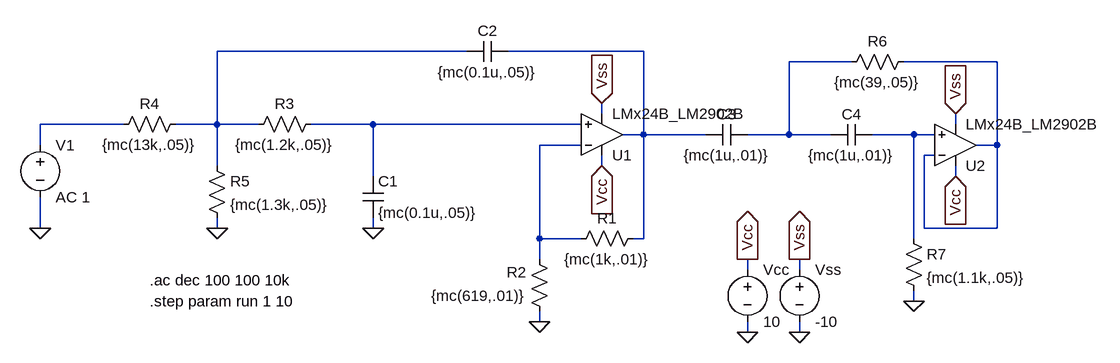
[diagram p0: schematic TP4 - copia.asc]
TP4 - copia.asc, the LTspice schematic file:
Version 4.1
SHEET 1 1700 680
WIRE 736 128 352 128
WIRE 1008 128 800 128
WIRE 1328 144 1232 144
WIRE 1552 144 1408 144
WIRE 944 224 944 208
WIRE 208 240 80 240
WIRE 352 240 352 128
WIRE 352 240 288 240
WIRE 416 240 352 240
WIRE 592 240 496 240
WIRE 912 240 592 240
WIRE 1488 240 1488 224
WIRE 1008 256 1008 128
WIRE 1008 256 976 256
WIRE 1104 256 1008 256
WIRE 1232 256 1232 144
WIRE 1232 256 1168 256
WIRE 1296 256 1232 256
WIRE 1424 256 1360 256
WIRE 1456 256 1424 256
WIRE 80 272 80 240
WIRE 912 272 848 272
WIRE 1552 272 1552 144
WIRE 1552 272 1520 272
WIRE 1456 288 1440 288
WIRE 352 304 352 240
WIRE 944 304 944 288
WIRE 592 320 592 240
WIRE 1488 320 1488 304
WIRE 80 400 80 352
WIRE 352 400 352 384
WIRE 592 400 592 384
WIRE 1440 400 1440 288
WIRE 1552 400 1552 272
WIRE 1552 400 1440 400
WIRE 848 416 848 272
WIRE 912 416 848 416
WIRE 1008 416 1008 256
WIRE 1008 416 992 416
WIRE 1424 416 1424 256
WIRE 848 448 848 416
WIRE 1168 464 1168 448
WIRE 1248 464 1248 448
WIRE 1424 512 1424 496
WIRE 848 544 848 528
WIRE 1168 560 1168 544
WIRE 1248 560 1248 544
FLAG 1168 560 0
FLAG 1248 560 0
FLAG 1168 448 Vcc
IOPIN 1168 448 Out
FLAG 1248 448 Vss
IOPIN 1248 448 Out
FLAG 352 400 0
FLAG 80 400 0
FLAG 592 400 0
FLAG 848 544 0
FLAG 944 304 Vcc
IOPIN 944 304 In
FLAG 944 208 Vss
IOPIN 944 208 In
FLAG 1488 224 Vss
IOPIN 1488 224 In
FLAG 1488 320 Vcc
IOPIN 1488 320 In
FLAG 1424 512 0
SYMBOL voltage 1168 448 R0
SYMATTR InstName Vcc
SYMATTR Value 10
SYMBOL voltage 1248 448 R0
SYMATTR InstName Vss
SYMATTR Value -10
SYMBOL res 304 224 R90
WINDOW 0 0 56 VBottom 2
WINDOW 3 32 56 VTop 2
SYMATTR InstName R4
SYMATTR Value {mc(13k,.05)}
SYMBOL res 336 288 R0
SYMATTR InstName R5
SYMATTR Value {mc(1.3k,.05)}
SYMBOL res 512 224 R90
WINDOW 0 0 56 VBottom 2
WINDOW 3 32 56 VTop 2
SYMATTR InstName R3
SYMATTR Value {mc(1.2k,.05)}
SYMBOL cap 576 320 R0
SYMATTR InstName C1
SYMATTR Value {mc(0.1u,.05)}
SYMBOL cap 800 112 R90
WINDOW 0 0 32 VBottom 2
WINDOW 3 32 32 VTop 2
SYMATTR InstName C2
SYMATTR Value {mc(0.1u,.05)}
SYMBOL LMx24B_LM2902B 944 256 M180
SYMATTR InstName U1
SYMBOL LMx24B_LM2902B 1488 272 M180
SYMATTR InstName U2
SYMBOL voltage 80 256 R0
SYMATTR InstName V1
SYMATTR Value AC 1
SYMBOL res 1008 400 R90
WINDOW 0 0 56 VBottom 2
WINDOW 3 32 56 VTop 2
SYMATTR InstName R1
SYMATTR Value {mc(1k,.01)}
SYMBOL res 864 544 R180
WINDOW 0 36 76 Left 2
WINDOW 3 36 40 Left 2
SYMATTR InstName R2
SYMATTR Value {mc(619,.01)}
SYMBOL cap 1168 240 R90
WINDOW 0 0 32 VBottom 2
WINDOW 3 32 32 VTop 2
SYMATTR InstName C3
SYMATTR Value {mc(1u,.01)}
SYMBOL cap 1360 240 R90
WINDOW 0 0 32 VBottom 2
WINDOW 3 32 32 VTop 2
SYMATTR InstName C4
SYMATTR Value {mc(1u,.01)}
SYMBOL res 1424 128 R90
WINDOW 0 0 56 VBottom 2
WINDOW 3 32 56 VTop 2
SYMATTR InstName R6
SYMATTR Value {mc(39,.05)}
SYMBOL res 1408 400 R0
SYMATTR InstName R7
SYMATTR Value {mc(1.1k,.05)}
TEXT 248 480 Left 2 !.ac dec 100 100 10k
TEXT 248 512 Left 2 !.step param run 1 10

The netlist it stands for:
* TP4 - copia.asc
Vcc Vcc 0 10
Vss Vss 0 -10
R4 N001 N005 {mc(13k,.05)}
R5 N001 0 {mc(1.3k,.05)}
R3 N006 N001 {mc(1.2k,.05)}
C1 N006 0 {mc(0.1u,.05)}
C2 N002 N001 {mc(0.1u,.05)}
* U1: LMx24B_LM2902B (symbol LMx24B_LM2902B not available, pins judged from their places): In+=N006 In-=N008 V+=Vcc V-=Vss OUT=N002
* U2: LMx24B_LM2902B (symbol LMx24B_LM2902B not available, pins judged from their places): In+=N007 In-=N004 V+=Vcc V-=Vss OUT=N004
V1 N005 0 AC 1
R1 N002 N008 {mc(1k,.01)}
R2 0 N008 {mc(619,.01)}
C3 N003 N002 {mc(1u,.01)}
C4 N007 N003 {mc(1u,.01)}
R6 N004 N003 {mc(39,.05)}
R7 N007 0 {mc(1.1k,.05)}
.ac dec 100 100 10k
.step param run 1 10
.backanno
.end